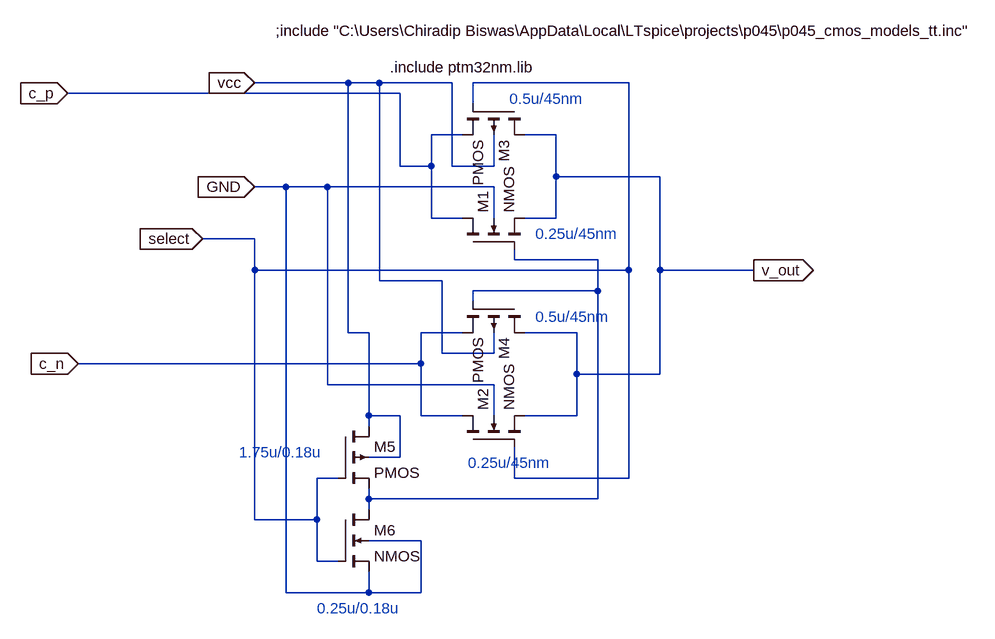
[diagram p0: schematic analog_2_to_1mux.asc]
analog_2_to_1mux.asc, the LTspice schematic file:
Version 4
SHEET 1 1128 872
WIRE 32 48 -112 48
WIRE 80 48 32 48
WIRE 192 48 80 48
WIRE 464 48 224 48
WIRE 112 64 -400 64
WIRE 224 80 224 48
WIRE 208 128 160 128
WIRE 352 128 304 128
WIRE 112 176 112 64
WIRE 160 176 160 128
WIRE 160 176 112 176
WIRE 192 176 192 48
WIRE 256 176 256 128
WIRE 256 176 192 176
WIRE 352 192 352 128
WIRE 512 192 352 192
WIRE -64 208 -112 208
WIRE 0 208 -64 208
WIRE 256 208 0 208
WIRE 160 256 160 176
WIRE 208 256 160 256
WIRE 256 256 256 208
WIRE 352 256 352 192
WIRE 352 256 304 256
WIRE -112 288 -192 288
WIRE 288 320 288 304
WIRE 416 320 288 320
WIRE -112 336 -112 288
WIRE 464 336 464 48
WIRE 464 336 -112 336
WIRE 512 336 512 192
WIRE 656 336 512 336
WIRE 80 352 80 48
WIRE 176 352 80 352
WIRE 416 368 416 320
WIRE 416 368 224 368
WIRE 224 384 224 368
WIRE 32 432 32 48
WIRE 64 432 32 432
WIRE 208 432 144 432
WIRE 384 432 304 432
WIRE 176 464 176 352
WIRE 256 464 256 432
WIRE 256 464 176 464
WIRE 144 480 144 432
WIRE 144 480 -384 480
WIRE 384 496 384 432
WIRE 512 496 512 336
WIRE 512 496 384 496
WIRE 0 512 0 208
WIRE 256 512 0 512
WIRE 64 560 64 432
WIRE 112 560 64 560
WIRE 144 560 144 480
WIRE 208 560 144 560
WIRE 256 560 256 512
WIRE 384 560 384 496
WIRE 384 560 304 560
WIRE 64 576 64 560
WIRE 112 624 112 560
WIRE 112 624 64 624
WIRE 16 656 -16 656
WIRE 288 656 288 608
WIRE 464 656 464 336
WIRE 464 656 288 656
WIRE 64 688 64 672
WIRE 416 688 416 368
WIRE 416 688 64 688
WIRE 64 704 64 688
WIRE -112 720 -112 336
WIRE -16 720 -16 656
WIRE -16 720 -112 720
WIRE 144 752 64 752
WIRE -16 784 -16 720
WIRE 16 784 -16 784
WIRE -64 832 -64 208
WIRE 64 832 64 800
WIRE 64 832 -64 832
WIRE 144 832 144 752
WIRE 144 832 64 832
FLAG 656 336 v_out
IOPIN 656 336 Out
FLAG -192 288 select
IOPIN -192 288 In
FLAG -400 64 c_p
IOPIN -400 64 In
FLAG -384 480 c_n
IOPIN -384 480 In
FLAG -112 208 GND
IOPIN -112 208 In
FLAG -112 48 vcc
IOPIN -112 48 In
SYMBOL nmos4 208 304 R270
SYMATTR InstName M1
SYMATTR Value2 l=45nm w=0.25u
SYMBOL nmos4 208 608 R270
SYMATTR InstName M2
SYMATTR Value2 l=45nm w=0.25u
SYMBOL pmos4 304 80 R90
SYMATTR InstName M3
SYMATTR Value2 l=45nm w=0.5u
SYMBOL pmos4 304 384 R90
SYMATTR InstName M4
SYMATTR Value2 l=45nm w=0.5u
SYMBOL pmos4 16 576 R0
SYMATTR InstName M5
SYMATTR Value2 l=0.18u w=1.75u
SYMBOL nmos4 16 704 R0
SYMATTR InstName M6
SYMATTR Value2 l=0.18u w=0.25u
TEXT 96 24 Left 2 !.include ptm32nm.lib
TEXT 280 72 Left 2 ;0.5u/45nm
TEXT 320 408 Left 2 ;0.5u/45nm
TEXT 320 280 Left 2 ;0.25u/45nm
TEXT 216 632 Left 2 ;0.25u/45nm
TEXT -136 616 Left 2 ;1.75u/0.18u
TEXT -16 856 Left 2 ;0.25u/0.18u
TEXT -80 -32 Left 2 !;include "C:\\Users\\Chiradip Biswas\\AppData\\Local\\LTspice\\projects\\p045\\p045_cmos_models_tt.inc"

The netlist it stands for:
* analog_2_to_1mux.asc
M1 c_p N001 v_out GND NMOS l=45nm w=0.25u
M2 c_n select v_out GND NMOS l=45nm w=0.25u
M3 v_out select c_p vcc PMOS l=45nm w=0.5u
M4 v_out N001 c_n vcc PMOS l=45nm w=0.5u
M5 vcc select N001 vcc PMOS l=0.18u w=1.75u
M6 N001 select GND GND NMOS l=0.18u w=0.25u
.model NMOS NMOS
.model PMOS PMOS
.lib standard.mos
.include ptm32nm.lib
* 0.5u/45nm
* 0.5u/45nm
* 0.25u/45nm
* 0.25u/45nm
* 1.75u/0.18u
* 0.25u/0.18u
;include "C:\Users\Chiradip Biswas\AppData\Local\LTspice\projects\p045\p045_cmos_models_tt.inc"
.backanno
.end